# Altium schematic sheet Buzzer.SchDoc: Piezzo Buzzer & Audio Amplifier
size 292 x 193 mm; DocumentNumber: 25; SheetNumber: 18; SheetTotal: 28
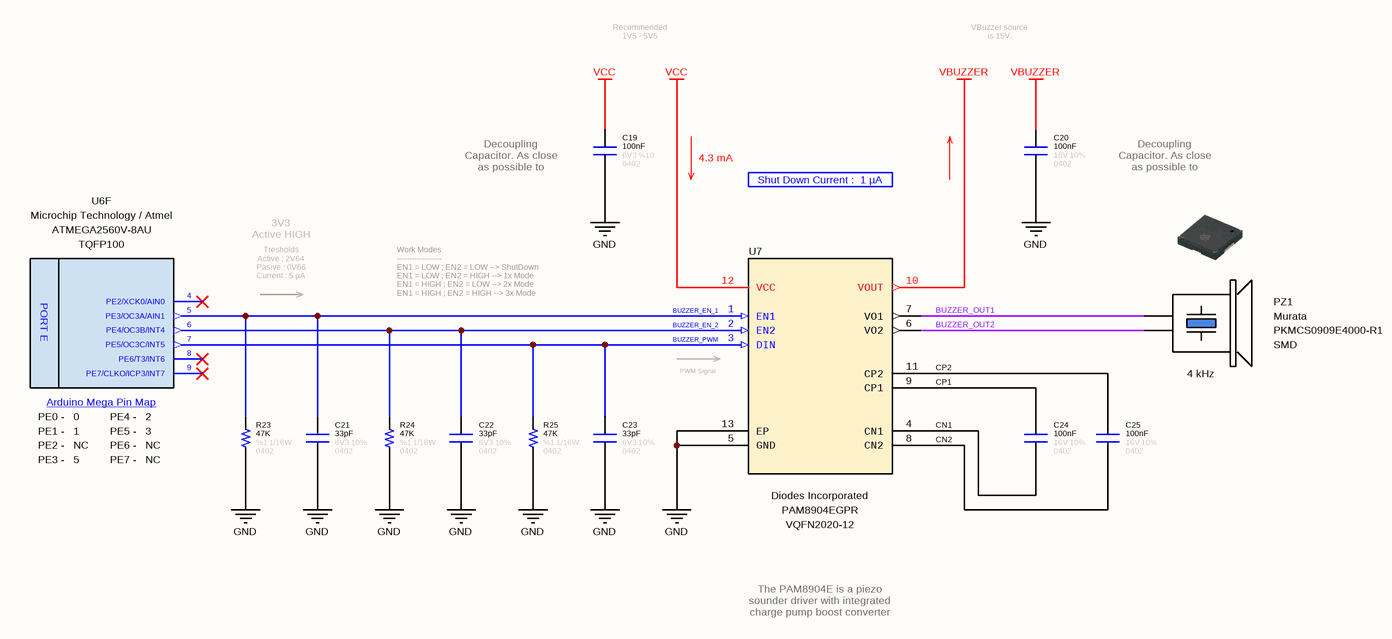
[diagram p0: Buzzer.SchDoc]

## Parts
C19  value 100nF  Tolerance: %10  Voltage: 6V3  Case: 0402  [CAPACITOR_0402]  (hidden comment: Capacitor - 100nF [0402] (Ceramic))
C20  value 100nF  Tolerance: 10%  Case: 0402  Voltage: 16V  [CAPACITOR_0402]  (hidden comment: Capacitor - 100nF [0402] (Ceramic))
C21  value 33pF  Tolerance: 10%  Case: 0402  Voltage: 6V3  [CAPACITOR_0402]  (hidden comment: Capacitor - 33pF [0402] (Ceramic))
C22  value 33pF  Tolerance: 10%  Case: 0402  Voltage: 6V3  [CAPACITOR_0402]  (hidden comment: Capacitor - 33pF [0402] (Ceramic))
C23  value 33pF  Tolerance: 10%  Case: 0402  Voltage: 6V3  [CAPACITOR_0402]  (hidden comment: Capacitor - 33pF [0402] (Ceramic))
C24  value 100nF  Tolerance: 10%  Case: 0402  Voltage: 16V  [CAPACITOR_0402]  (hidden comment: Capacitor - 100nF [0402] (Ceramic))
C25  value 100nF  Tolerance: 10%  Case: 0402  Voltage: 16V  [CAPACITOR_0402]  (hidden comment: Capacitor - 100nF [0402] (Ceramic))
PZ1  Manufacturer Name: Murata  Case: SMD  Frequency: 4 kHz  [Murata - Buzzer]  (hidden comment: PKMCS0909E4000-R1)
R23  value 47K  Tolerance: %1  Case: 0402  Power: 1/16W  [RESISTOR_0402]  (hidden comment: 47K - 0402 - %1 - 1/16W)
R24  value 47K  Tolerance: %1  Case: 0402  Power: 1/16W  [RESISTOR_0402]  (hidden comment: 47K - 0402 - %1 - 1/16W)
R25  value 47K  Tolerance: %1  Case: 0402  Power: 1/16W  [RESISTOR_0402]  (hidden comment: 47K - 0402 - %1 - 1/16W)
U6  Manufacturer Name: Microchip Technology / Atmel  Case: TQFP100  [TQFP-100]  (hidden comment: ATMEGA2560V-8AU)  (part F of 16)
U7  Manufacturer Name: Diodes Incorporated  Case: VQFN2020-12  [U-QFN2020-12]  (hidden comment: PAM8904EGPR)

## Nets
GND: C19.1 C20.1 C21.1 C22.1 C23.1 R23.1 R24.1 R25.1 U7.5(GND) U7.13(EP)
VBUZZER: C20.2 U7.10(VOUT)
VCC: C19.2 U7.12(VCC)
BUZZER_EN_1: C21.2 R23.2 U6.5(PE3/OC3A/AIN1) U7.1(EN1)
BUZZER_EN_2: C22.2 R24.2 U6.6(PE4/OC3B/INT4) U7.2(EN2)
BUZZER_OUT1: PZ1.1(+) U7.7(VO1)
BUZZER_OUT2: PZ1.2(-) U7.6(VO2)
BUZZER_PWM: C23.2 R25.2 U6.7(PE5/OC3C/INT5) U7.3(DIN)
CN1: C24.1 U7.4(CN1)
CN2: C25.1 U7.8(CN2)
CP1: C24.2 U7.9(CP1)
CP2: C25.2 U7.11(CP2)

Not connected (* = marked no-connect by the designer): U6 4(PE2/XCK0/AIN0)* 8(PE6/T3/INT6)* 9(PE7/CLKO/ICP3/INT7)*

## Notes on the sheet
- Recommended 1V5 - 5V5
- VBuzzer source is 15V.
- (near C19) Decoupling Capacitor. As close as possible to PAM8904 pin-12.
- 4.3 mA
- Shut Down Current :  1 µA
- Decoupling Capacitor. As close as possible to PAM8904 pin-10.
- 3V3
  Active HIGH
- Tresholds
  Active : 2V64
  Pasive : 0V66
  Current : 5 µA
- Work Modes
  ------------------
  EN1 = LOW ; EN2 = LOW --> ShutDown
  EN1 = LOW ; EN2 = HIGH --> 1x Mode
  EN1 = HIGH ; EN2 = LOW --> 2x Mode
  EN1 = HIGH ; EN2 = HIGH --> 3x Mode
- (near U7) PWM Signal
- The PAM8904E is a piezo sounder driver with integrated charge pump boost converter
- © 2021 All rights reserved.
  This document may not, in whole or in part, be copied, photocopied, reproduced, translated or converted to any electronic or machine readable from without prior written permission of Mehmet Günce Akkoyun.
  Engineer contact : akkoyun@me.com
- Property of
- Engineer :
- Date :
- Size :
- A4
- Time :
- Project :
- Page :
- /
- Customer :
- Product ID :
- Module ID :
- Version :
- File :
- Revision :
- (in symbol IC - AtMega2560V-8AU, part F) PORT E; Arduino Mega Pin Map; PE0 -; 0; PE4 -; PE1 -; PE5 -; PE2 -; NC; PE6 -; PE3 -; PE7 -

## Library data of the parts
C19 = Capacitor - 100nF [0402-6V3]: Capacitor - 100nF [0402-6V3] (Ceramic); Manufacturer Name: AVX; Manufacturer Part Number: 04026D104KAT4A; ComponentLink1Description: Mouser; ComponentLink1URL: https://www.mouser.com.tr/ProductDetail/AVX/04026D104KAT4A?qs=sGAEpiMZZMs0AnBnWHyRQPg4iYkCw7IMED%2F4kpqgf7w%3D; ComponentLink2Description: DataSheet; ComponentLink2URL: https://www.mouser.com.tr/datasheet/2/40/cx5r-776519.pdf
C20 C24 C25 = Capacitor - 100nF [0402-16V]: Multilayer Ceramic Capacitors - SMD - 16V 100nF X7R 0402 10%; Manufacturer Name: AVX; Manufacturer Part Number: 0402YC104KAT2A
C21-C23 = Capacitor - 33pF [0402-6V3]: Manufacturer Name: Kemet; Manufacturer Part Number: C0402C330J9RACAUTO; ComponentLink1Description: DataSheet; ComponentLink1URL: https://api.kemet.com/component-edge/download/datasheet/C0402C330J9RACAUTO.pdf; ComponentLink2Description: Mouser; ComponentLink2URL: https://www.mouser.com/Search/Refine.aspx?Keyword=80-C0402C330J9RAUTO
PZ1 = Buzzer - PKMCS0909E4000-R1: MURATA - PKMCS0909E4000-R1 - Transducer, Piezo, Sounder, Sounder, -12.5 VDC, 12.5 VDC, 65 dB; Sound Pressure Level: 65 dBA; Voltage Rating: 12.5 V; Product Type: Piezo Buzzers; RoHS: Yes; Manufacturer Part Number: PKMCS0909E4000-R1
R23-R25 = Resistor - 47K [0402]: Thick Film Resistors - SMD 1/16 W 47 KOhm 1%; Manufacturer Name: Vishay; Manufacturer Part Number: CRCW040247K0FKED; ComponentLink1Description: DataSheet; ComponentLink1URL: https://www.mouser.com.tr/datasheet/2/427/dcrcwe3-1762152.pdf; ComponentLink2Description: Mouser; ComponentLink2URL: https://www.mouser.com.tr/ProductDetail/Vishay-Dale/CRCW040247K0FKED?qs=sGAEpiMZZMu61qfTUdNhG2DpbjADlD3GL%252B3h1elTxqU%3D
U6 = IC - AtMega2560V-8AU: ATmega Series 256 KB Flash 8 KB SRAM 8 MHz 8-Bit Microcontroller - TQFP-100; Program Memory Size: 256 kB; Core: AVR; Operating Supply Voltage: 2.7 V to 5.5 V; Maximum Clock Frequency: 8 MHz; Maximum Operating Temperature: + 85 C; Product Type: MicroControllers; Minimum Operating Temperature: - 40 C; Manufacturer Part Number: ATMEGA2560V-8AU
U7 = IC - PAM8904: 27VPP Piezo Sounder Driver, 1.5 to 5.5V, 0.22mA; Operating Supply Current: 7.9 mA; Supply Voltage - Min: 1.5 V; RoHS: Yes; Maximum Operating Temperature: + 85 C; Minimum Operating Temperature: - 40 C; Product Type: Audio Amplifiers; Supply Voltage - Max: 5.5 V; Manufacturer Part Number: PAM8904EGPR